# EAGLE design timerboard (EAGLE 5.07)
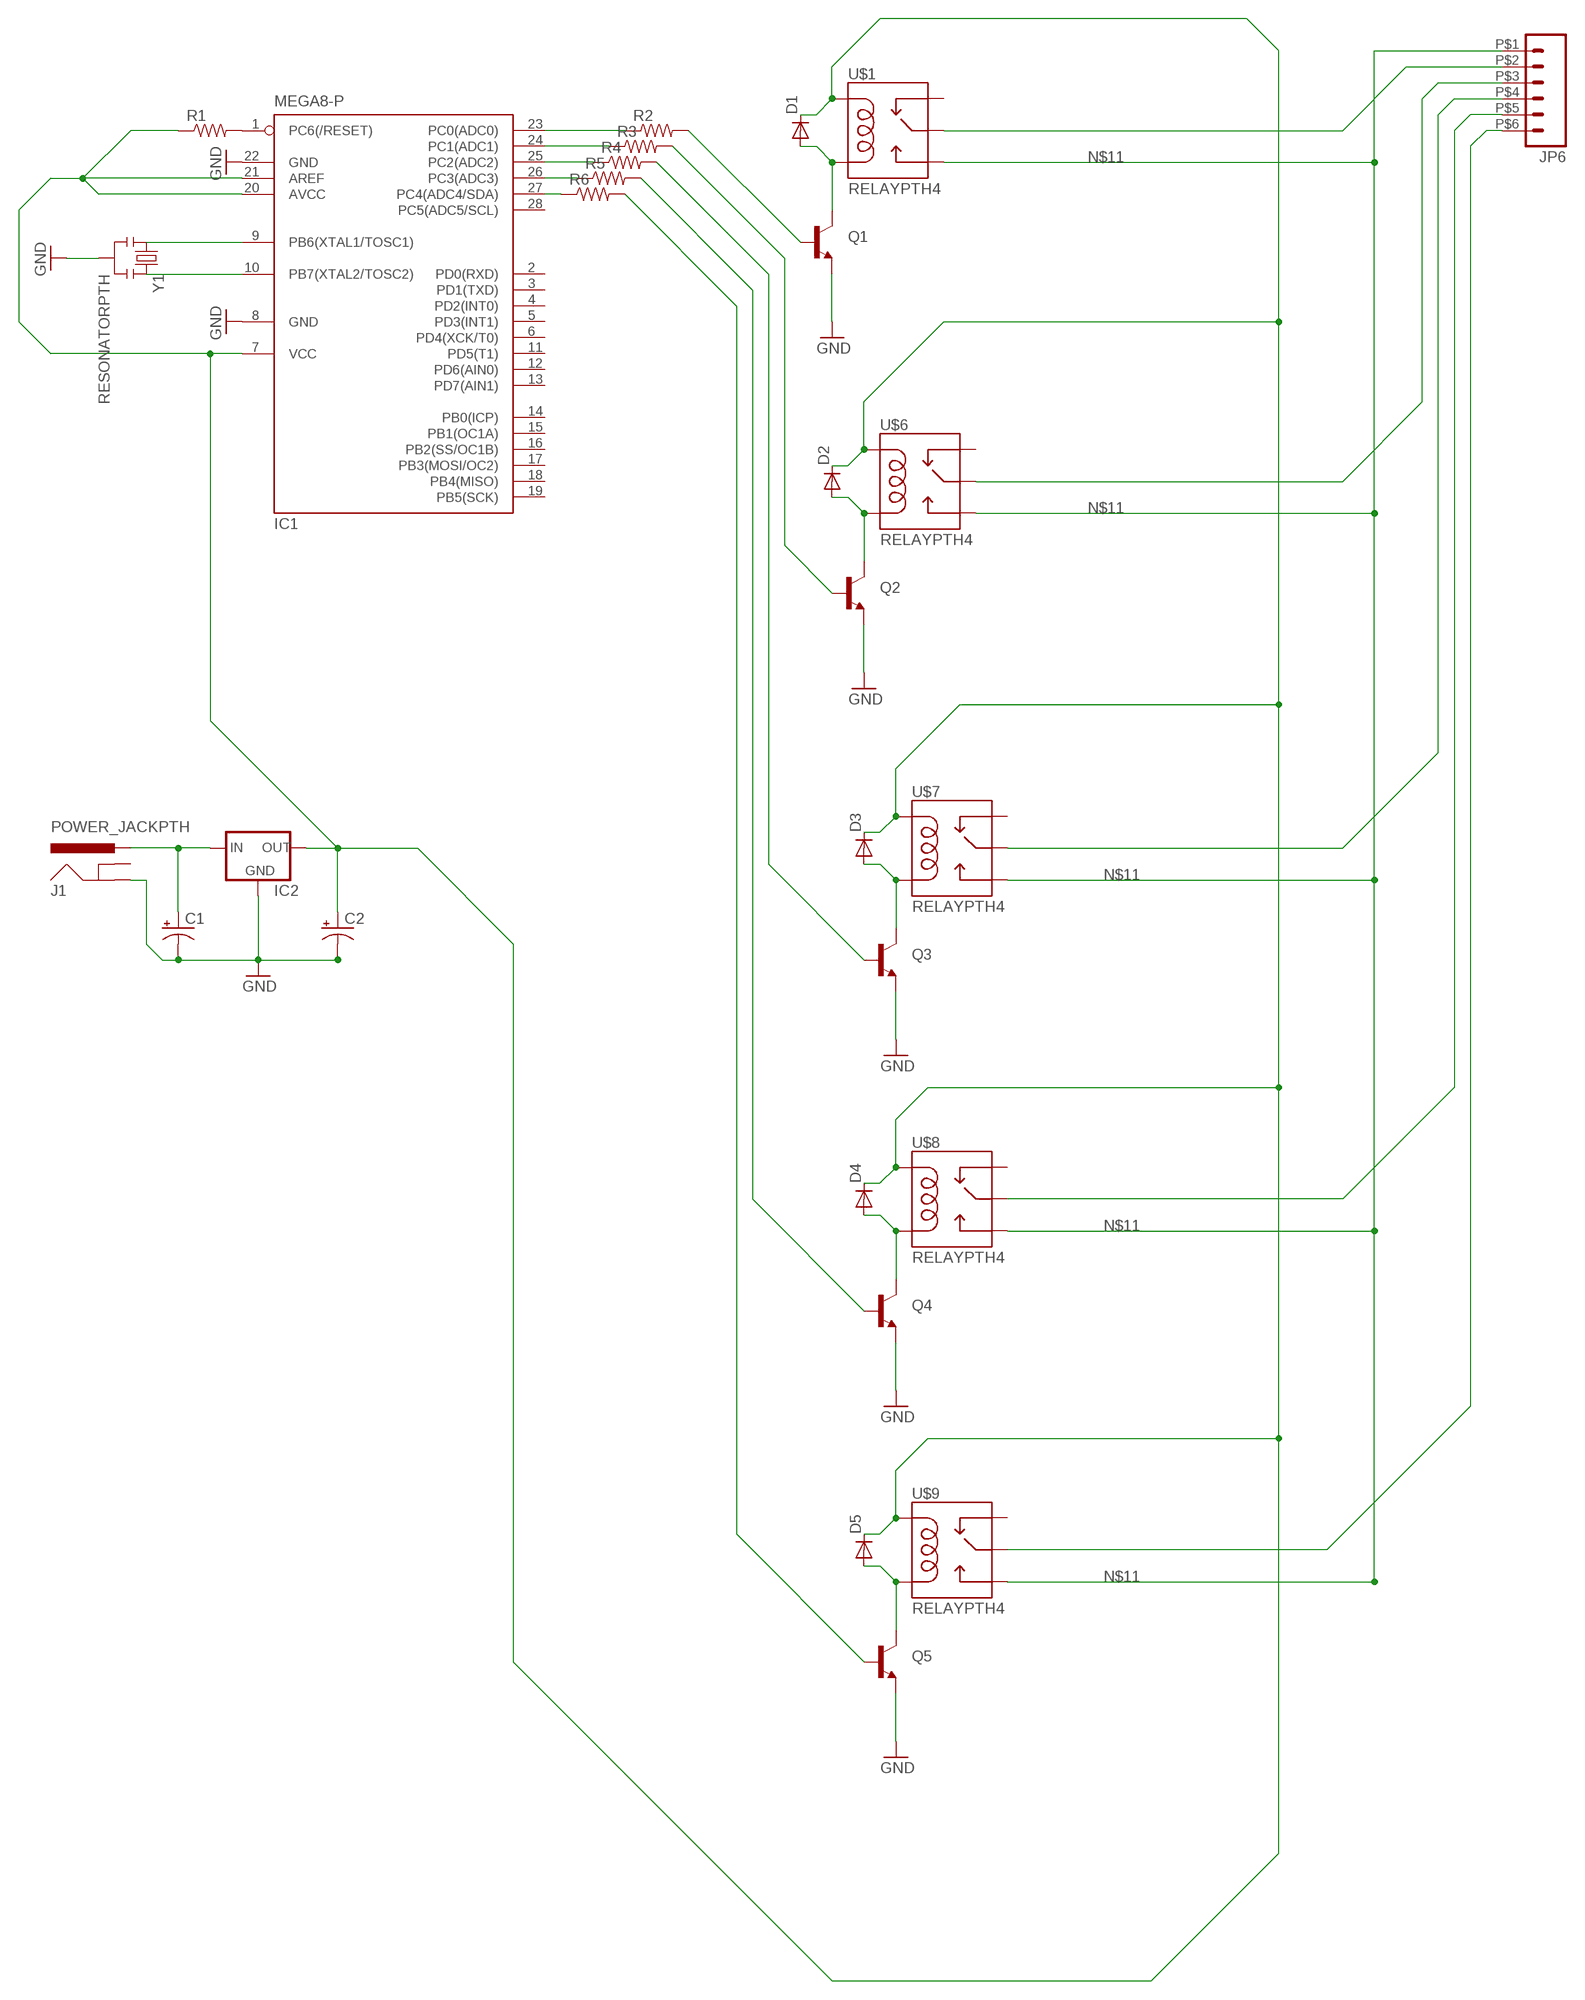
[diagram p0: schematic, sheet 1]

## Parts
C1  CAP_POLPTH2  [CPOL-RADIAL-10UF-25V]
C2  CAP_POLPTH2  [CPOL-RADIAL-10UF-25V]
D1  DIODE1N4148  [DIODE-1N4148]
D2  DIODE1N4148  [DIODE-1N4148]
D3  DIODE1N4148  [DIODE-1N4148]
D4  DIODE1N4148  [DIODE-1N4148]
D5  DIODE1N4148  [DIODE-1N4148]
IC1  MEGA8-P  [DIL28-3]
IC2  V_REG_78XXSINK  [TO220-IGO]
J1  POWER_JACKPTH  [POWER_JACK_PTH]
JP6  M06BARRIER_TERMINAL_BLOCK  [1X06_BARRIER_TERMINAL_BLOCK]
Q1  TRANSISTOR_NPNTO-92-AMMO  [TO-92-AMMO]
Q2  TRANSISTOR_NPNTO-92-AMMO  [TO-92-AMMO]
Q3  TRANSISTOR_NPNTO-92-AMMO  [TO-92-AMMO]
Q4  TRANSISTOR_NPNTO-92-AMMO  [TO-92-AMMO]
Q5  TRANSISTOR_NPNTO-92-AMMO  [TO-92-AMMO]
R1  RESISTORPTH-1/4W  [AXIAL-0.4]
R2  RESISTORPTH-1/4W  [AXIAL-0.4]
R3  RESISTORPTH-1/4W  [AXIAL-0.4]
R4  RESISTORPTH-1/4W  [AXIAL-0.4]
R5  RESISTORPTH-1/4W  [AXIAL-0.4]
R6  RESISTORPTH-1/4W  [AXIAL-0.4]
U$1  RELAYPTH4  [RELAY-JZC]
U$6  RELAYPTH4  [RELAY-JZC]
U$7  RELAYPTH4  [RELAY-JZC]
U$8  RELAYPTH4  [RELAY-JZC]
U$9  RELAYPTH4  [RELAY-JZC]
Y1  RESONATORPTH  [RESONATOR-PTH]

## Nets
GND: C1.2(-) C2.2(-) IC1.8(GND) IC1.22(GND) IC2.GND J1.GND Q1.1(E) Q2.1(E) Q3.1(E) Q4.1(E) Q5.1(E) Y1.2
N$1: IC1.10(PB7(XTAL2/TOSC2)) Y1.3
N$2: D1.A Q1.3(C) U$1.1(COIL2)
N$3: IC1.9(PB6(XTAL1/TOSC1)) Y1.1
N$4: IC1.1(PC6(/RESET)) R1.P$2
N$5: Q1.2(B) R2.P$2
N$7: JP6.P$3 U$6.4(MAIN)
N$8: D2.A Q2.3(C) U$6.1(COIL2)
N$9: Q2.2(B) R3.P$2
N$11: JP6.P$1 U$1.3(NO) U$6.3(NO) U$7.3(NO) U$8.3(NO) U$9.3(NO)
N$12: JP6.P$2 U$1.4(MAIN)
N$13: JP6.P$4 U$7.4(MAIN)
N$14: D3.A Q3.3(C) U$7.1(COIL2)
N$15: Q3.2(B) R4.P$2
N$17: JP6.P$5 U$8.4(MAIN)
N$18: D4.A Q4.3(C) U$8.1(COIL2)
N$19: Q4.2(B) R5.P$2
N$21: JP6.P$6 U$9.4(MAIN)
N$22: D5.A Q5.3(C) U$9.1(COIL2)
N$23: Q5.2(B) R6.P$2
N$24: C1.1(+) IC2.IN J1.PWR
N$25: C2.1(+) D1.C D2.C D3.C D4.C D5.C IC1.7(VCC) IC1.20(AVCC) IC1.21(AREF) IC2.OUT R1.P$1 U$1.5(COIL1) U$6.5(COIL1) U$7.5(COIL1) U$8.5(COIL1) U$9.5(COIL1)
N$28: IC1.23(PC0(ADC0)) R2.P$1
N$29: IC1.24(PC1(ADC1)) R3.P$1
N$30: IC1.25(PC2(ADC2)) R4.P$1
N$31: IC1.26(PC3(ADC3)) R5.P$1
N$32: IC1.27(PC4(ADC4/SDA)) R6.P$1
Unconnected: IC1.2(PD0(RXD)) IC1.3(PD1(TXD)) IC1.4(PD2(INT0)) IC1.5(PD3(INT1)) IC1.6(PD4(XCK/T0)) IC1.11(PD5(T1)) IC1.12(PD6(AIN0)) IC1.13(PD7(AIN1)) IC1.14(PB0(ICP)) IC1.15(PB1(OC1A)) IC1.16(PB2(SS/OC1B)) IC1.17(PB3(MOSI/OC2)) IC1.18(PB4(MISO)) IC1.19(PB5(SCK)) IC1.28(PC5(ADC5/SCL)) J1.GNDBREAK U$1.2(NC) U$6.2(NC) U$7.2(NC) U$8.2(NC) U$9.2(NC)

## Library data of the parts
C1 C2 = SparkFun:CAP_POL: Capacitor Polarized These are standard SMD and PTH capacitors. Normally 10uF, 47uF, and 100uF in electrolytic and tantalum varieties. Always verify the external diameter of the through hole cap, it varies with capacity, voltage, and manufacturer. The EIA devices should be standard.
D1-D5 = SparkFun:DIODE: Diode These are standard reverse protection diodes and small signal diodes. SMA package can handle up to about 1A. SOD-323 can handle about 200mA. What the SOD-323 package when ordering, there are some mfgs out there that are 5-pin packages.
IC1 = atmel:MEGA8-P: MICROCONTROLLER 8 Kbytes FLASH, 1 kbytes SRAM, 512 bytes EEPROM, USART, 4-channel 10 bit ADC, 2-channel 8 bit ADC Pin compatible with Atmega48, ATMega88, ATMega168 Source: avr.lbr
IC2 = SparkFun:V_REG_78XX: Voltage Regulator Standard 7805 5V regulator. IGO (Input Ground Output). Spark Fun Electronics SKU : COM-00107
J1 = SparkFun:POWER_JACK: Power Jack This is the standard 5.5mm barrel jack for power. The PTH is the most common, proven, reliable, footprint. All others are experimental. The Slot footprint only works if the mill layer is transmitted to the PCB fab house so be warned. Spark Fun Electronics SKU : PRT-00119. Mating wall wart : TOL-00298 (and others)
JP6 = SparkFun:M06: Header 6 Standard 6-pin 0.1" header. Use with straight break away headers (SKU : PRT-00116), right angle break away headers (PRT-00553), swiss pins (PRT-00743), machine pins (PRT-00117), and female headers (PRT-00115). Molex polarized connector foot print use with SKU : PRT-08094 with associated crimp pins and housings. NOTES ON THE VARIANTS LOCK and LOCK_LONGPADS... This footprint was designed to help hold the alignment of a through-hole component (i.e. 6-pin header) while soldering it into place. You may notice that each hole has been shifted either up or down by 0.005 of an inch from it's more standard position (which is a perfectly straight line). This slight alteration caused the pins (the squares in the middle) to touch the edges of the holes. Because they are alternating, it causes a "brace" to hold the component in place. 0.005 has proven to be the perfect amount of "off-center" position when using our standard breakaway headers. Although looks a little odd when you look at the bare footprint, once you have a header in there, the alteration is very hard to notice. Also, if you push a header all the way into place, it is covered up entirely on the bottom side. This idea of altering the position of holes to aid alignment will be further integrated into the Sparkfun Library for other footprints. It can help hold any component with 3 or more connection pins.
Q1-Q5 = SparkFun:TRANSISTOR_NPN: Transistor NPN BJT configuration in SOT23 package. MMBT2222 is the common NPN we use. Double check BCE configuration again layout.
R1-R6 = SparkFun:RESISTOR: Resistor Basic schematic elements and footprints for 0603, 1206, and PTH resistors.
U$1 U$6-U$9 = SparkFun:RELAY
Y1 = SparkFun:RESONATOR: Resonator Small SMD resonator. This is the itty bitty 10/20MHz resonators with built in caps. CSTCE10M0G55 and CSTCE20M0V53. Footprint has been reviewed closely but hasn't been tested yet.

## Board
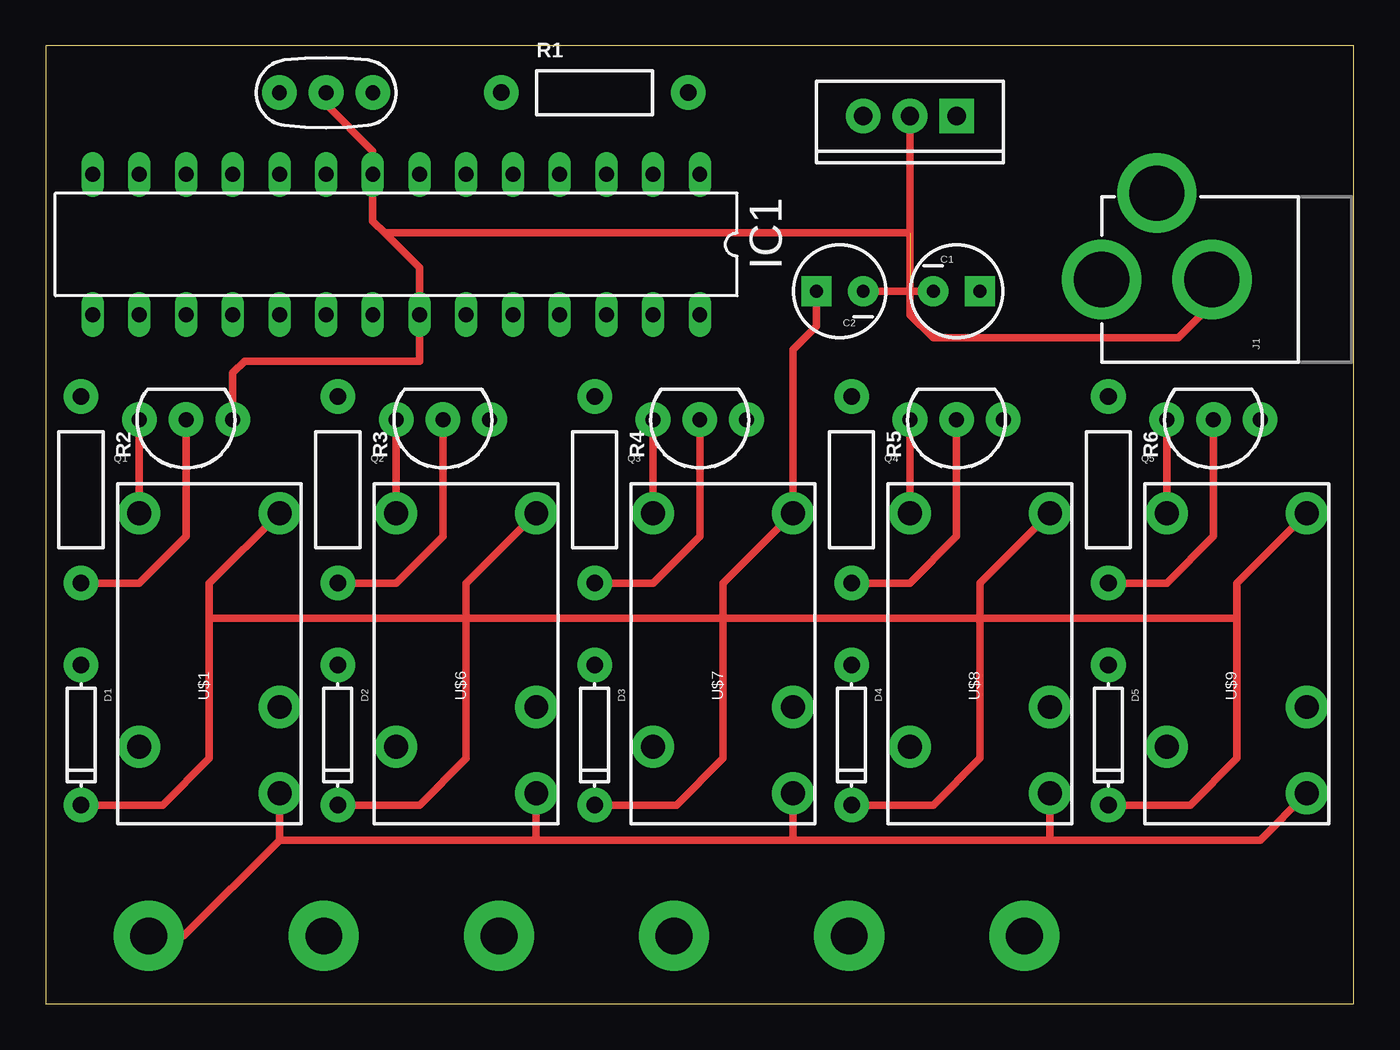
[diagram p1: board, top side]
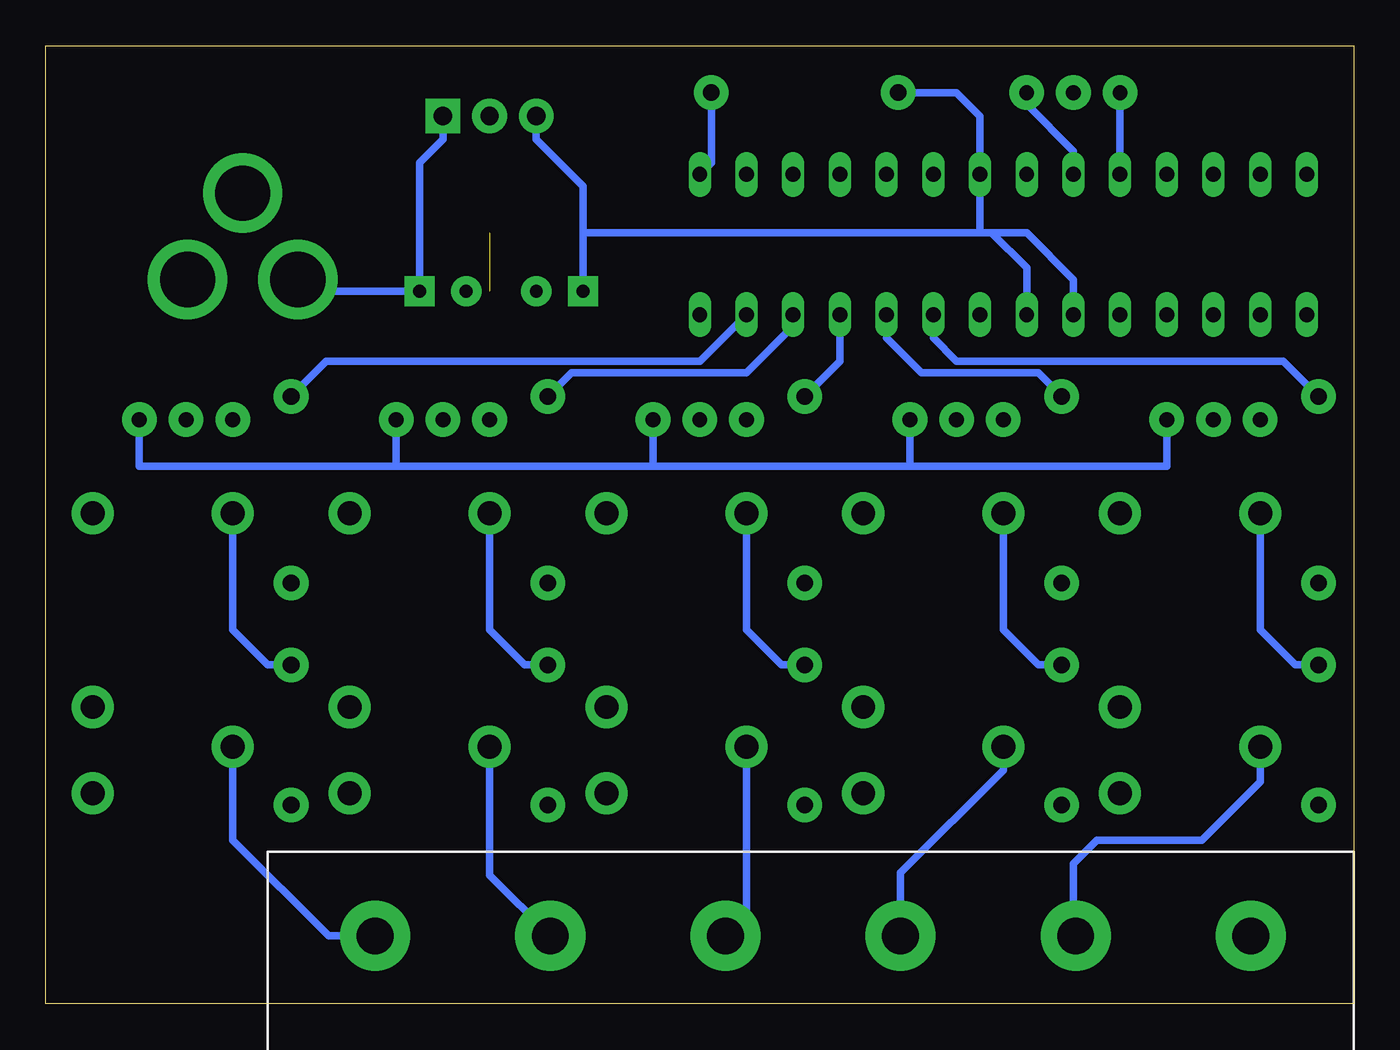
[diagram p2: board, bottom side, seen from below]

Size 71.12 x 52.07 mm. Coordinates in mm from the lower left corner, seen from the top.
Outline: 0,0 71.12,0 71.12,52.07 0,52.07 0,0
Copper layers (1*16): Top 0.0356mm / dielectric 1.5011mm / Bottom 0.0356mm
Design rules "LaenPCBOrder": minimum track width 6mil, minimum drill 13mil, track to track 6mil, track to pad 6mil, pad to pad 6mil, via to via 6mil, smd to smd 6mil, copper to edge 15mil, drill to drill 6mil, minimum pad ring 7mil, minimum via ring 7mil, stop-mask expansion 4mil, vias tented up to drill 0mil, thermal gap 10mil

### Footprints (pad centres in the part's own frame; a part is rotated, then mirrored left to right if it is on the bottom)
CPOL-RADIAL-10UF-25V = drill 0.7 pad 1.651 square: 1 1.27,0 | drill 0.7 pad 1.651 round: 2 -1.27,0
DIODE-1N4148 = drill 0.9 pad 1.88 round: A -3.81,0; C 3.81,0
DIL28-3 = drill 0.813 long: 1 -16.51,-3.81; 2 -13.97,-3.81; 3 -11.43,-3.81; 4 -8.89,-3.81; 5 -6.35,-3.81; 6 -3.81,-3.81; 7 -1.27,-3.81; 8 1.27,-3.81; 9 3.81,-3.81; 10 6.35,-3.81; 11 8.89,-3.81; 12 11.43,-3.81; 13 13.97,-3.81; 14 16.51,-3.81; 15 16.51,3.81; 16 13.97,3.81; 17 11.43,3.81; 18 8.89,3.81; 19 6.35,3.81; 20 3.81,3.81; 21 1.27,3.81; 22 -1.27,3.81; 23 -3.81,3.81; 24 -6.35,3.81; 25 -8.89,3.81; 26 -11.43,3.81; 27 -13.97,3.81; 28 -16.51,3.81
TO220-IGO = drill 1 pad 1.88 round: GND 0,0; OUT 2.54,0 | drill 1 pad 1.88 square: IN -2.54,0
POWER_JACK_PTH = drill 2.997 pad 4.318 round: GND 0,7.7; GNDBREAK 4.7,10.7; PWR 0,13.7
1X06_BARRIER_TERMINAL_BLOCK = drill 2 pad 3.81 round: P$1 5.588,4.572; P$2 15.113,4.572; P$3 24.638,4.572; P$4 34.163,4.572; P$5 43.688,4.572; P$6 53.213,4.572
TO-92-AMMO = drill 0.813 pad 1.88 round: 1 -2.54,0; 2 0,0; 3 2.54,0
AXIAL-0.4 = drill 0.9 pad 1.88 round: P$1 -5.08,0; P$2 5.08,0
RELAY-JZC = drill 1.3 pad 2.286 round: 1 3.81,-8.89; 2 -3.81,1.651; 3 -3.81,6.35; 4 3.81,3.81; 5 -3.81,-8.89
RESONATOR-PTH = drill 0.8 pad 1.88 round: 1 -2.54,0; 2 0,0; 3 2.54,0

### Placement (x,y rotation side)
C1  49.53,38.73 0 top
C2  43.18,38.73 180 top
D1  1.91,14.61 270 top
D2  15.88,14.61 270 top
D3  29.84,14.61 270 top
D4  43.81,14.61 270 top
D5  57.78,14.61 270 top
IC1  19.05,41.27 180 top
IC2  46.99,48.26 180 top
J1  71.12,39.37 90 top
JP6  0,8.26 180 bottom
Q1  7.62,31.75 180 top
Q2  21.59,31.75 180 top
Q3  35.56,31.75 180 top
Q4  49.53,31.75 180 top
Q5  63.5,31.75 180 top
R1  29.84,49.53 0 top
R2  1.91,27.94 270 top
R3  15.88,27.94 270 top
R4  29.84,27.94 270 top
R5  43.81,27.94 270 top
R6  57.78,27.94 270 top
U$1  8.89,17.78 180 top
U$6  22.86,17.78 180 top
U$7  36.83,17.78 180 top
U$8  50.8,17.78 180 top
U$9  64.77,17.78 180 top
Y1  15.24,49.53 180 top

### Tracks (layer width: path | path; a pad name or v marks a point on that pad's centre or on a via)
GND  (1 unrouted)
  Top 0.406: Y1.2 15.24,48.9 17.78,46.35 IC1.8 17.78,42.55 18.41,41.91 | 18.41,41.91 20.32,40.01 IC1.22 20.32,34.92 10.79,34.92 10.16,34.29 Q1.1 | 18.41,41.91 46.99,41.91 | J1.GND 63.42,38.02 61.59,36.2 48.26,36.2 46.99,37.47 46.99,38.73 | 46.99,38.73 IC2.GND | C2.2 46.99,38.73 | 46.99,38.73 C1.2
  Bottom 0.406: Q1.1 10.16,29.21 24.13,29.21 | 24.13,29.21 38.1,29.21 | 38.1,29.21 52.07,29.21 | 52.07,29.21 66.04,29.21 Q5.1 | 24.13,29.21 Q2.1 | 38.1,29.21 Q3.1 | 52.07,29.21 Q4.1
N$1
  Bottom 0.406: IC1.10 Y1.3
N$2
  Top 0.406: U$1.1 Q1.3
  Bottom 0.406: D1.A 3.17,18.41 5.08,20.32 U$1.1
N$3
  Bottom 0.406: IC1.9 15.24,46.35 17.78,48.9 Y1.1
N$4
  Bottom 0.406: R1.P$2 34.92,45.72 IC1.1
N$5
  Top 0.406: R2.P$2 5.08,22.86 7.62,25.4 Q1.2
N$7
  Bottom 0.406: U$6.4 19.05,12.7 24.64,7.11 JP6.P$3
N$8
  Top 0.406: U$6.1 Q2.3
  Bottom 0.406: D2.A 17.14,18.41 19.05,20.32 U$6.1
N$9
  Top 0.406: R3.P$2 19.05,22.86 21.59,25.4 Q2.2
N$11
  Top 0.406: JP6.P$1 7.49,3.68 12.7,8.89 | 12.7,8.89 U$1.3 | 12.7,8.89 26.67,8.89 | 26.67,8.89 40.64,8.89 | 40.64,8.89 54.61,8.89 | 54.61,8.89 66.04,8.89 U$9.3 | 26.67,8.89 U$6.3 | 40.64,8.89 U$7.3 | 54.61,8.89 U$8.3
N$12
  Bottom 0.406: U$1.4 5.08,12.06 8.26,8.89 13.97,8.89 15.24,7.62 15.24,3.81 JP6.P$2
N$13
  Bottom 0.406: JP6.P$4 33.02,4.83 U$7.4
N$14
  Top 0.406: U$7.1 Q3.3
  Bottom 0.406: D3.A 31.11,18.41 33.02,20.32 U$7.1
N$15
  Top 0.406: R4.P$2 33.02,22.86 35.56,25.4 Q3.2
N$17
  Bottom 0.406: JP6.P$5 46.99,6.99 U$8.4
N$18
  Top 0.406: U$8.1 Q4.3
  Bottom 0.406: D4.A 45.09,18.41 46.99,20.32 U$8.1
N$19
  Top 0.406: R5.P$2 46.99,22.86 49.53,25.4 Q4.2
N$21
  Bottom 0.406: JP6.P$6 55.75,3.68 60.96,8.89 U$9.4
N$22
  Top 0.406: U$9.1 Q5.3
  Bottom 0.406: D5.A 59.05,18.41 60.96,20.32 U$9.1
N$23
  Top 0.406: R6.P$2 60.96,22.86 63.5,25.4 Q5.2
N$24
  Bottom 0.406: IC2.IN 49.53,46.99 50.8,45.72 C1.1 56.78,38.73 J1.PWR
N$25
  Top 0.406: D1.C 6.35,10.79 8.89,13.34 8.89,20.95 | 8.89,20.95 8.89,22.86 U$1.5 | 22.86,20.95 22.86,22.86 U$6.5 | 36.83,20.95 36.83,22.86 U$7.5 40.64,35.56 41.91,36.83 C2.1 | 50.8,20.95 50.8,22.86 U$8.5 | 64.77,20.95 64.77,13.34 62.23,10.79 D5.C | 64.77,20.95 64.77,22.86 U$9.5 | 8.89,20.95 22.86,20.95 | 22.86,20.95 22.86,13.34 20.32,10.79 D2.C | 22.86,20.95 36.83,20.95 | 36.83,20.95 36.83,13.34 34.29,10.79 D3.C | 36.83,20.95 50.8,20.95 | 50.8,20.95 50.8,13.34 48.26,10.79 D4.C | 50.8,20.95 64.77,20.95
  Bottom 0.406: IC1.20 15.24,39.37 17.78,41.91 19.68,41.91 | 20.32,41.91 IC1.7 20.32,48.26 21.59,49.53 R1.P$1 | 20.32,41.91 19.68,41.91 | IC1.21 17.78,40.01 19.68,41.91 | IC2.OUT 44.45,46.99 41.91,44.45 41.91,41.91 | 41.91,41.91 20.32,41.91 | C2.1 41.91,41.91
N$28
  Bottom 0.406: IC1.23 22.86,36.2 21.59,34.92 3.81,34.92 R2.P$1
N$29
  Bottom 0.406: IC1.24 25.4,36.2 23.5,34.29 17.14,34.29 R3.P$1
N$30
  Bottom 0.406: IC1.25 27.94,34.92 R4.P$1
N$31
  Bottom 0.406: IC1.26 30.48,36.83 33.02,34.29 42.55,34.29 R5.P$1
N$32
  Bottom 0.406: IC1.27 35.56,34.92 55.88,34.92 R6.P$1